# Altium schematic sheet Sheet3_W5500_2.SchDoc
size 420 x 297 mm; SheetNumber: 2; SheetTotal: 3; 2oboznachenieDocumenta: АСТА.468353.021 Э3; 1.2naimenovanieDocumenta: Схема электрическая принципиальная; 7poryadkoviiNomerLista: 3; 8obscheeKolichestvoListov: 3; 13.1dataPodpisiRazrabotchika: 22.02.23
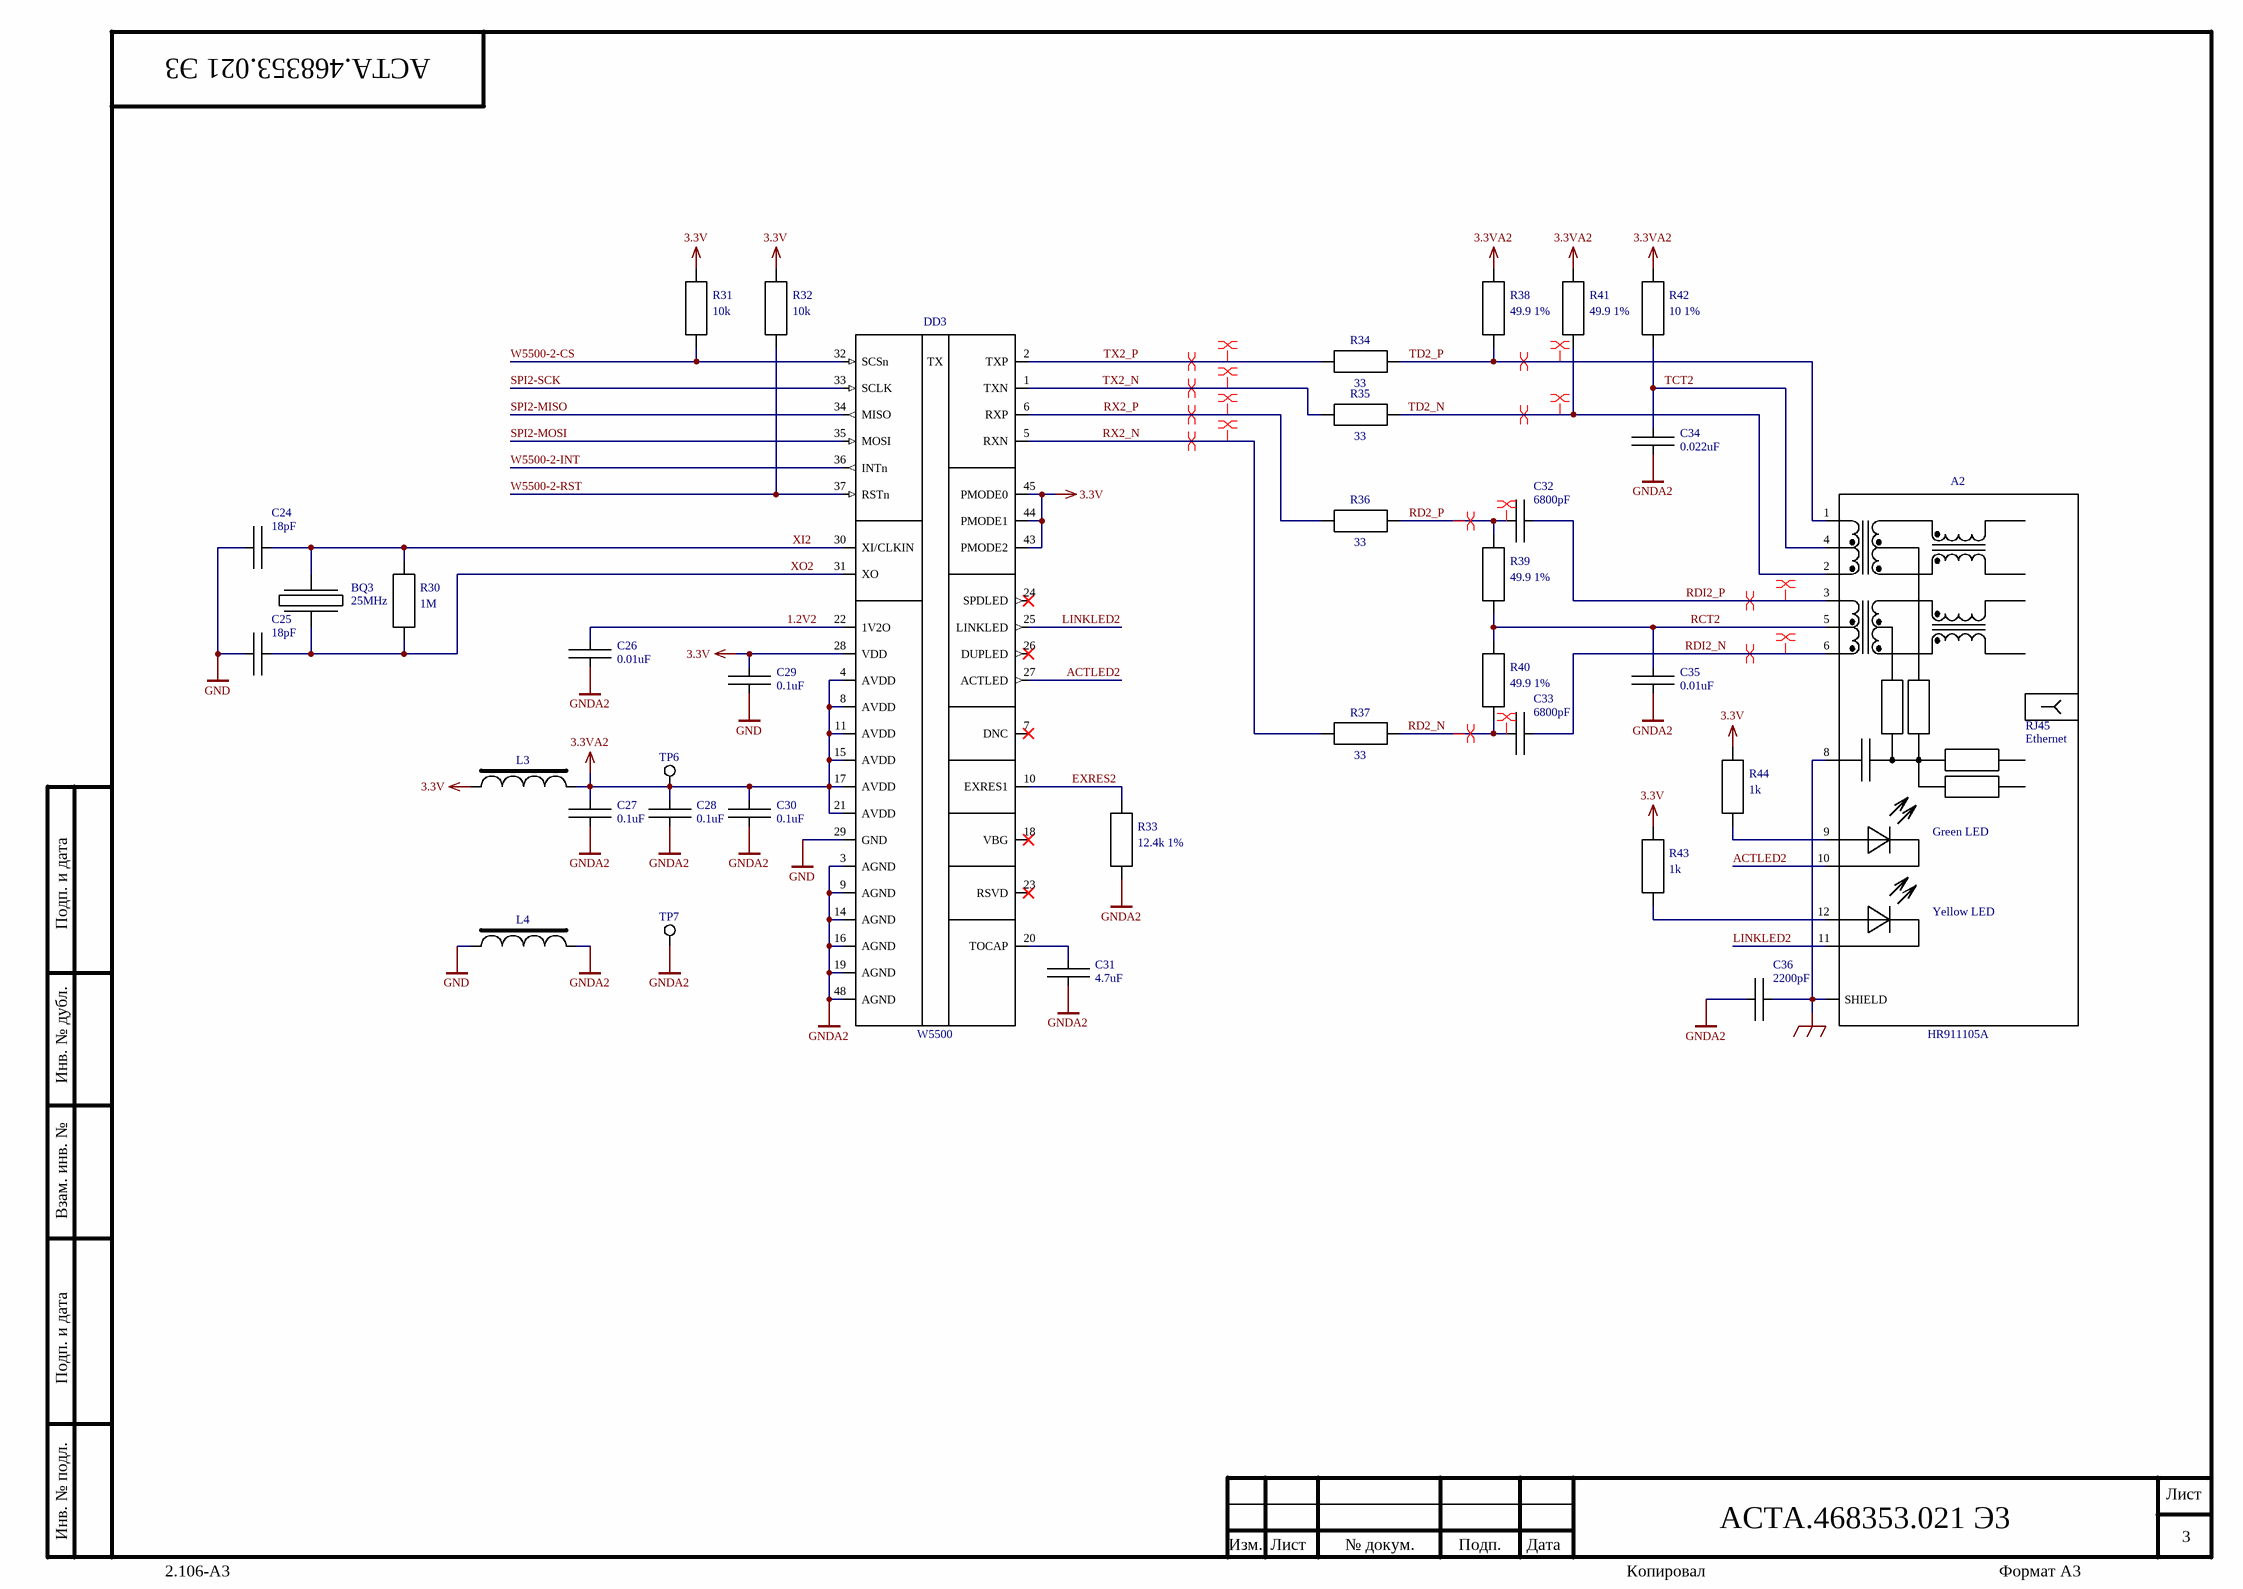
[diagram p0: Sheet3_W5500_2.SchDoc]

## Parts
A2  HR911105A  [HR911105A]
BQ3  value 25MHz  [HT-49S]  (hidden comment: HT-49S_Rated)
C24  value 18pF  [CAP0805]  (hidden comment: CAP0805_Rated)
C25  value 18pF  [CAP0805]  (hidden comment: CAP0805_Rated)
C26  value 0.01uF  [CAP0805]  (hidden comment: CAP0805_Rated)
C27  value 0.1uF  [CAP0805]  (hidden comment: CAP0805_Rated)
C28  value 0.1uF  [CAP0805]  (hidden comment: CAP0805_Rated)
C29  value 0.1uF  [CAP0805]  (hidden comment: CAP0805_Rated)
C30  value 0.1uF  [CAP0805]  (hidden comment: CAP0805_Rated)
C31  value 4.7uF  [CAP1206]  (hidden comment: CAP1206_Rated)
C32  value 6800pF  [CAP0805]  (hidden comment: CAP0805_Rated)
C33  value 6800pF  [CAP0805]  (hidden comment: CAP0805_Rated)
C34  value 0.022uF  [CAP0805]  (hidden comment: CAP0805_Rated)
C35  value 0.01uF  [CAP0805]  (hidden comment: CAP0805_Rated)
C36  value 2200pF  [CAP1812]  (hidden comment: CAP1812_Rated)
DD3  W5500  [LQFP-48]
L3  BLM21BD121SN1D  [IND0805]  (value not drawn)
L4  BLM21BD121SN1D  [IND0805]  (value not drawn)
R30  value 1M  [RES0805]  (hidden comment: RES0805_Rated)
R31  value 10k  [RES0805]  (hidden comment: RES0805_Rated)
R32  value 10k  [RES0805]  (hidden comment: RES0805_Rated)
R33  value 12.4k 1%  [RES0805]  (hidden comment: RES0805_Rated)
R34  value 33  [RES0805]  (hidden comment: RES0805_Rated)
R35  value 33  [RES0805]  (hidden comment: RES0805_Rated)
R36  value 33  [RES0805]  (hidden comment: RES0805_Rated)
R37  value 33  [RES0805]  (hidden comment: RES0805_Rated)
R38  value 49.9 1%  [RES0805]  (hidden comment: RES0805_Rated)
R39  value 49.9 1%  [RES0805]  (hidden comment: RES0805_Rated)
R40  value 49.9 1%  [RES0805]  (hidden comment: RES0805_Rated)
R41  value 49.9 1%  [RES0805]  (hidden comment: RES0805_Rated)
R42  value 10 1%  [RES0805]  (hidden comment: RES0805_Rated)
R43  value 1k  [RES0805]  (hidden comment: RES0805_Rated)
R44  value 1k  [RES0805]  (hidden comment: RES0805_Rated)
TP6  TestPad  [PAD-TH-OCT1x1-0.5]  (value not drawn)  (no BOM)
TP7  TestPad  [PAD-TH-OCT1x1-0.5]  (value not drawn)  (no BOM)

## Nets
3.3V: C29.1 DD3.28(VDD) DD3.43(PMODE2) DD3.44(PMODE1) DD3.45(PMODE0) L3.1 R31.2 R32.2 R43.2 R44.2
3.3VA2: C27.1 C28.1 C30.1 DD3.4(AVDD) DD3.8(AVDD) DD3.11(AVDD) DD3.15(AVDD) DD3.17(AVDD) DD3.21(AVDD) L3.2 R38.2 R41.2 R42.2 TP6.1
EARTH: A2.8(GND) A2.SHIELD C36.2
GND: C24.1 C25.1 C29.2 DD3.29(GND) L4.1
GNDA2: C26.2 C27.2 C28.2 C30.2 C31.2 C34.2 C35.2 C36.1 DD3.3(AGND) DD3.9(AGND) DD3.14(AGND) DD3.16(AGND) DD3.19(AGND) DD3.48(AGND) L4.2 R33.1 TP7.1
1.2V2: C26.1 DD3.22(1V2O)
ACTLED2: A2.10(LED1-K) DD3.27(ACTLED)
EXRES2: DD3.10(EXRES1) R33.2
LINKLED2: A2.11(LED2-A) DD3.25(LINKLED)
RCT2: A2.5(CT) C35.1 R39.1 R40.2
RD2_N: C33.1 R37.2 R40.1
RD2_P: C32.1 R36.2 R39.2
RDI2_N: A2.6(RD-) C33.2
RDI2_P: A2.3(RD+) C32.2
RX2_N: DD3.5(RXN) R37.1
RX2_P: DD3.6(RXP) R36.1
SPI2-MISO: DD3.34(MISO)
SPI2-MOSI: DD3.35(MOSI)
SPI2-SCK: DD3.33(SCLK)
TCT2: A2.4(CT) C34.1 R42.1
TD2_N: A2.2(TD-) R35.2 R41.1
TD2_P: A2.1(TD+) R34.2 R38.1
TX2_N: DD3.1(TXN) R35.1
TX2_P: DD3.2(TXP) R34.1
W5500-2-CS: DD3.32(SCSn) R31.1
W5500-2-INT: DD3.36(INTn)
W5500-2-RST: DD3.37(RSTn) R32.1
XI2: BQ3.1 C24.2 DD3.30(XI/CLKIN) R30.2
XO2: BQ3.2 C25.2 DD3.31(XO) R30.1
NetA2_9: A2.9(LED1-A) R44.1
NetA2_12: A2.12(LED2-K) R43.1
NetC31_1: C31.1 DD3.20(TOCAP)

Not connected (* = marked no-connect by the designer): DD3 7(DNC)* 18(VBG)* 23(RSVD)* 24(SPDLED)* 26(DUPLED)*

## Layout directives
differential pair: RD2_N, RD2_P, RDI2_N, RDI2_P, RX2_N, RX2_P, TD2_N, TD2_P, TX2_N, TX2_P
net class ETHERNET: RD2_N, RD2_P, RDI2_N, RDI2_P, RX2_N, RX2_P, TD2_N, TD2_P, TX2_N, TX2_P

## Notes on the sheet
- Подп. и дата
- Инв. № дубл.
- Взам. инв. №
- Инв. № подл.
- Изм.
- Лист
- № докум.
- Подп.
- Дата
- 2.106-A3
- Копировал
- Формат А3
- (in symbol HR911105A) RJ45; Ethernet; Green LED; Yellow LED
- (in symbol W5500) TX

## Library data of the parts
A2 = HR911105A: Ethernet Connector 10/100 1x1 Tab Down RJ45 w/mag G/Y LED
DD3 = W5500: Ethernet ICs 3in1 Enet Controller TCP/IP +MAC+PHY
L3 L4 = BLM21BD121SN1D: Ferrite Bead 0805 120 Ohm; Manufacturer: Murata; Value: 120 Ohm; 1Ccode: М00053470; 1Cname: BLM21BD121SN1D MUR; 1Cgroup: 01010901; 1Carticle: 42076; Name: Фильтр BLM21BD121SN1D; Tolerance: 25%; RatedCurrent: 200mA; DCResistance: 0.25 Ohm; 1CfullName: BLM21BD121SN1D MUR; PartNumber: BLM21BD121SN1D; ComponentLink1Description: DatasheetLink; ComponentLink1URL: *; Case: 0805
R30-R44 = RES0805_Rated: Tolerance: 5%; 1Ccode: *; 1Cname: *; 1CfullName: *; 1Cgroup: *; 1Carticle: *; Name: *; Manufacturer: *; PartNumber: *; DatasheetLink: *; Case: *
TP6 TP7 = TestPad: TestPoint on PCB; Label: "Label"
BQ3 = HT-49S_Rated: 1Ccode: *; 1Cname: *; 1CfullName: *; 1Cgroup: *; 1Carticle: *; Manufacturer: *; Name: *; PartNumber: *; Case: *; Tolerance: *; ComponentLink1Description: DatasheetLink; ComponentLink1URL: *; Frequency: *
C24-C30 C32-C35 = CAP0805_Rated: 1Ccode: *; 1Cname: *; 1CfullName: *; 1Cgroup: *; 1Carticle: *; Manufacturer: *; Name: *; PartNumber: *; ComponentLink1Description: DatasheetLink; ComponentLink1URL: *; Case: 0805; Tolerance: *; RatedVoltage: *; TemperatureCharacteristic: *
C31 = CAP1206_Rated: 1Ccode: *; 1Cname: *; 1CfullName: *; 1Cgroup: *; 1Carticle: *; Manufacturer: *; Name: *; PartNumber: *; ComponentLink1Description: DatasheetLink; ComponentLink1URL: *; Case: 1206; Tolerance: *; RatedVoltage: *; TemperatureCharacteristic: *
C36 = CAP1812_Rated: 1Ccode: *; 1Cname: *; 1CfullName: *; 1Cgroup: *; 1Carticle: *; Manufacturer: *; Name: *; PartNumber: *; ComponentLink1Description: DatasheetLink; ComponentLink1URL: *; Case: 1812; Tolerance: *; RatedVoltage: *; TemperatureCharacteristic: *